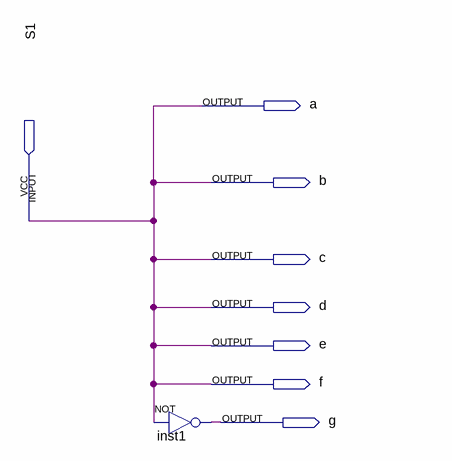
[diagram p0: schematic sheet]
// Quartus schematic Display_Signal.bdf as structural Verilog: 1 symbols, 8 pins
module Display_Signal (
  input  S1,
  output a,
  output b,
  output c,
  output d,
  output e,
  output f,
  output g
);

  not inst1 (g, S1);

  assign a = S1;
  assign b = S1;
  assign c = S1;
  assign d = S1;
  assign e = S1;
  assign f = S1;
endmodule
